# Altium schematic sheet MOSFET_V2.SchDoc
size A4; SheetNumber: 3; SheetTotal: 4
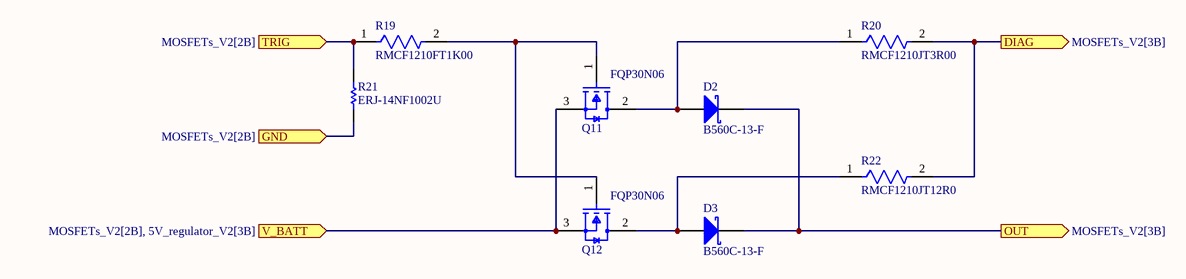
[diagram p0: MOSFET_V2.SchDoc]

## Parts
D2  B560C-13-F  [DIOD-B5X0C-2_M]
D3  B560C-13-F  [DIOD-B5X0C-2_M]
Q11  FQP30N06  [FP-340AT-MFG]
Q12  FQP30N06  [FP-340AT-MFG]
R19  RMCF1210FT1K00  [FP-RMCF1210-IPC_A]
R20  RMCF1210JT3R00  [FP-RMCF1210-IPC_A]
R21  ERJ-14NF1002U  [RESC3225X70X50NL20T20]
R22  RMCF1210JT12R0  [FP-RMCF1210-IPC_B]

## Ports
DIAG (out, see MOSFETs_V2[3B]), GND (in, see MOSFETs_V2[2B]), OUT (out, see MOSFETs_V2[3B]), TRIG (in, see MOSFETs_V2[2B]), V_BATT (in, see MOSFETs_V2[2B], 5V_regulator_V2[3B])

## Nets
DIAG: R20.2 R22.2 ; port DIAG
GND: R21.2 ; port GND
OUT: D2.1(K) D3.1(K) ; port OUT
TRIG: R19.1 R21.1 ; port TRIG
V_BATT: Q11.3(S) Q12.3(S) ; port V_BATT
NetD2_2: D2.2(A) Q11.2(D) R20.1
NetD3_2: D3.2(A) Q12.2(D) R22.1
NetQ11_1: Q11.1(G) Q12.1(G) R19.2

## Library data of the parts
D2 D3 = CMP-2000-05098-2: Schottky Barrier Rectifier, 5 A, 60 V, -55 to 125 degC, 2-Pin SMD, RoHS, Tape and Reel; Ir - Reverse Current: 500uA; Configuration: Single; Ifsm - Forward Surge Current: 100A; Vrrm - Repetitive Reverse Voltage: 60V; Brand: DiodesIncorporated; Vf - Forward Voltage: 0.7V; If - Forward Current: 5A; Unit Weight: 0.007408oz; Type: SchottkyBarrierRectifier; Package / Case: SMC; Manufacturer URL: http://www.diodes.com/; Datasheet URL: https://datasheet.ciiva.com/27052/1538961-27052355.pdf; Factory Pack Quantity: 3000; Height: 2.5mm; Width: 6.22mm; Product Category: SchottkyDiodes&Rectifiers; Minimum Operating Temperature: -55C; Manufacturer: DiodesIncorporated; Datasheet Version: Rev. 7-2, 06/2007; Product: SchottkyDiodes; Maximum Operating Temperature: +125C; Operating Temperature Range: -55Cto+125C; Technology: Si; Length: 7.11mm; RoHS: True; Packaging: Reel; Termination Style: SMD/SMT; Series: B560; Mounting Style: SMD/SMT
Q11 Q12 = CMP-07173-000001-1: MOSFET N-CH 60V 30A TO-220; Manufacturer: ON Semiconductor; Threshold Vgs Min: 2V; Power Dissipation: 79W; Rthja Max: 62.5°C/W; Gate To Source Voltage: 25V; Pulse Drain Current: 120A; Transconductance: 16S; Gate Charge At Vgs: 19nC @ 10V; Number Of Channels: 1; Standoff Height: 2.7mm; Input Capacitace At Vds: 725pF @ 25V; Max Junction Temp: +175°C; Depletion Mode: False; Reverse Recovery Charge: 65nC; Threshold Vgs Max: 4V; Max Forward Diode Voltage: 1.5V; Turn On Delay Time: 10ns; Reverse Recovery Time: 45ns; Drain To Source Resistance: 0.031Ω; Turn Off Delay Time: 35ns; Continuous Drain Current: 30A; Manufacturer Part Number: FQP30N06; Octopart: https://octopart.com/fqp30n06-on+semiconductor-84328004; Temperature: -55°C to +175°C; Ipc Land Pattern Name: TO-220; Digikey Description: MOSFET N-CH 60V 30A TO-220; Height: 20.4mm; RoHS: TRUE; Mouser Description: MOSFET 60V N-Channel QFET; Device Class L2: Transistors; Automotive: No; Footprint Url: https://www.onsemi.com/pub/Collateral/340AT.PDF; Number Of N Channels: 1; Device Class L1: Discrete Semiconductors; Package: 340AT; Temperature Range High: +175°C; Temperature Range Low: -55°C; ComponentLink2URL: https://www.onsemi.com/pub/Collateral/FQP30N06-D.pdf; Drain To Source Breakdown Voltage: 60V; Category: Trans; ComponentLink2Description: Datasheet; Device Class L3: MOSFETs; Drain To Source Voltage: 60V; Lead Free: Yes
R19 = CMP-26527-007195-1: 1kΩ ±1% 0.5W 1210 Thick Film Chip Resistor AEC-Q200 compliant; Max Power Dissipation: 333mW; Temperature Coefficient: 100ppm/°C; Resistance: 1kR; Lead Free: Lead Free; Radiation Hardening: No; Min Operating Temperature: -55°C; RoHS Compliant: Yes; Length: 3.2mm; Height: 0.028inch; Contact Plating: Tin; Resistor Type: Thick Film; Case Code (Metric): 3225; Case Code (Imperial): 1210; Military Standard: Not; Tolerance: 1%; Series: RMCF; Features: Automotive AEC-Q200; Case/Package: 1210; Max Operating Temperature: 155°C; Construction: Rectangular; Number of Terminations: 2; Width: 0.098inch; Depth: 2.5mm; Mount: Surface Mount; Packaging: Tape and Reel
R20 = CMP-26527-000722-1: 3Ω ±5% 0.5W 1210 Thick Film Chip Resistor AEC-Q200 compliant; Temperature Coefficient: 400ppm/°C; Max Power Dissipation: 500mW; Resistance: 3R; Length: 0.126inch; Case/Package: 1210; Mount: Surface Mount; Resistor Type: Thick Film; Radiation Hardening: No; Tolerance: 5%; Min Operating Temperature: -55°C; Features: Automotive AEC-Q200; Max Operating Temperature: 155°C; Contact Plating: Tin; Series: RMCF; Case Code (Metric): 3225; Number of Terminations: 2; Height: 0.028inch; RoHS Compliant: Yes; Case Code (Imperial): 1210; Packaging: Tape and Reel; Width: 0.098inch
R21 = CMP-1015-00623-2: Manufacturer: Panasonic; Part Number: ERJ-14NF1002U
R22 = CMP-26527-003986-1: 12Ω ±5% 0.5W 1210 Thick Film Chip Resistor AEC-Q200 compliant; Temperature Coefficient: 200ppm/°C; Max Power Dissipation: 500mW; Resistance: 12R; Resistor Type: Thick Film; Case/Package: 1210; Tolerance: 5%; Length: 0.126inch; Height: 0.028inch; Contact Plating: Tin; Width: 0.098inch; Mount: Surface Mount; Radiation Hardening: No; Number of Terminations: 2; Min Operating Temperature: -55°C; Series: RMCF; Packaging: Tape and Reel; RoHS Compliant: Yes; Max Operating Temperature: 155°C; Features: Automotive AEC-Q200